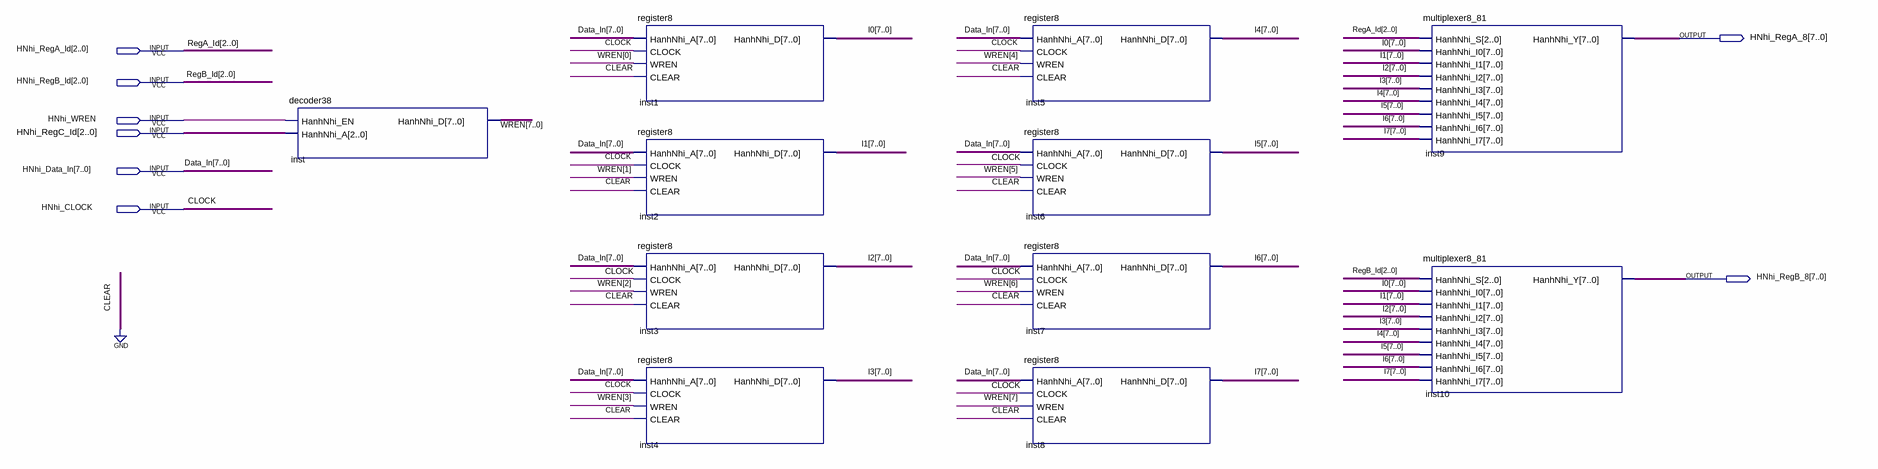
[diagram p0: schematic sheet]
// Quartus schematic Assignment5.bdf as structural Verilog: 11 symbols, 8 pins
module Assignment5 (
  input  [2:0] HNhi_RegA_Id,
  input  [2:0] HNhi_RegB_Id,
  input  HNhi_WREN,
  input  [2:0] HNhi_RegC_Id,
  input  [7:0] HNhi_Data_In,
  input  HNhi_CLOCK,
  output [7:0] HNhi_RegA_8,
  output [7:0] HNhi_RegB_8
);

  wire [7:0] I0, I1, I2, I3, I4, I5, I6, I7, WREN;

  decoder38 inst (.HanhNhi_EN(HNhi_WREN), .HanhNhi_A(HNhi_RegC_Id), .HanhNhi_D(WREN));
  register8 inst1 (.HanhNhi_A(HNhi_Data_In), .CLOCK(HNhi_CLOCK), .WREN(WREN[0]), .CLEAR(1'b0), .HanhNhi_D(I0));
  register8 inst2 (.HanhNhi_A(HNhi_Data_In), .CLOCK(HNhi_CLOCK), .WREN(WREN[1]), .CLEAR(1'b0), .HanhNhi_D(I1));
  register8 inst3 (.HanhNhi_A(HNhi_Data_In), .CLOCK(HNhi_CLOCK), .WREN(WREN[2]), .CLEAR(1'b0), .HanhNhi_D(I2));
  register8 inst4 (.HanhNhi_A(HNhi_Data_In), .CLOCK(HNhi_CLOCK), .WREN(WREN[3]), .CLEAR(1'b0), .HanhNhi_D(I3));
  register8 inst5 (.HanhNhi_A(HNhi_Data_In), .CLOCK(HNhi_CLOCK), .WREN(WREN[4]), .CLEAR(1'b0), .HanhNhi_D(I4));
  register8 inst6 (.HanhNhi_A(HNhi_Data_In), .CLOCK(HNhi_CLOCK), .WREN(WREN[5]), .CLEAR(1'b0), .HanhNhi_D(I5));
  register8 inst7 (.HanhNhi_A(HNhi_Data_In), .CLOCK(HNhi_CLOCK), .WREN(WREN[6]), .CLEAR(1'b0), .HanhNhi_D(I6));
  register8 inst8 (.HanhNhi_A(HNhi_Data_In), .CLOCK(HNhi_CLOCK), .WREN(WREN[7]), .CLEAR(1'b0), .HanhNhi_D(I7));
  multiplexer8_81 inst9 (
    .HanhNhi_S(HNhi_RegA_Id), .HanhNhi_I0(I0), .HanhNhi_I1(I1), .HanhNhi_I2(I2), .HanhNhi_I3(I3),
    .HanhNhi_I4(I4), .HanhNhi_I5(I5), .HanhNhi_I6(I6), .HanhNhi_I7(I7), .HanhNhi_Y(HNhi_RegA_8));
  multiplexer8_81 inst10 (
    .HanhNhi_S(HNhi_RegB_Id), .HanhNhi_I0(I0), .HanhNhi_I1(I1), .HanhNhi_I2(I2), .HanhNhi_I3(I3),
    .HanhNhi_I4(I4), .HanhNhi_I5(I5), .HanhNhi_I6(I6), .HanhNhi_I7(I7), .HanhNhi_Y(HNhi_RegB_8));

  // Other names for the same wires on the sheet: CLOCK = HNhi_CLOCK; Data_In[7:0] = HNhi_Data_In;
  //   RegA_Id[2:0] = HNhi_RegA_Id; RegB_Id[2:0] = HNhi_RegB_Id
endmodule
